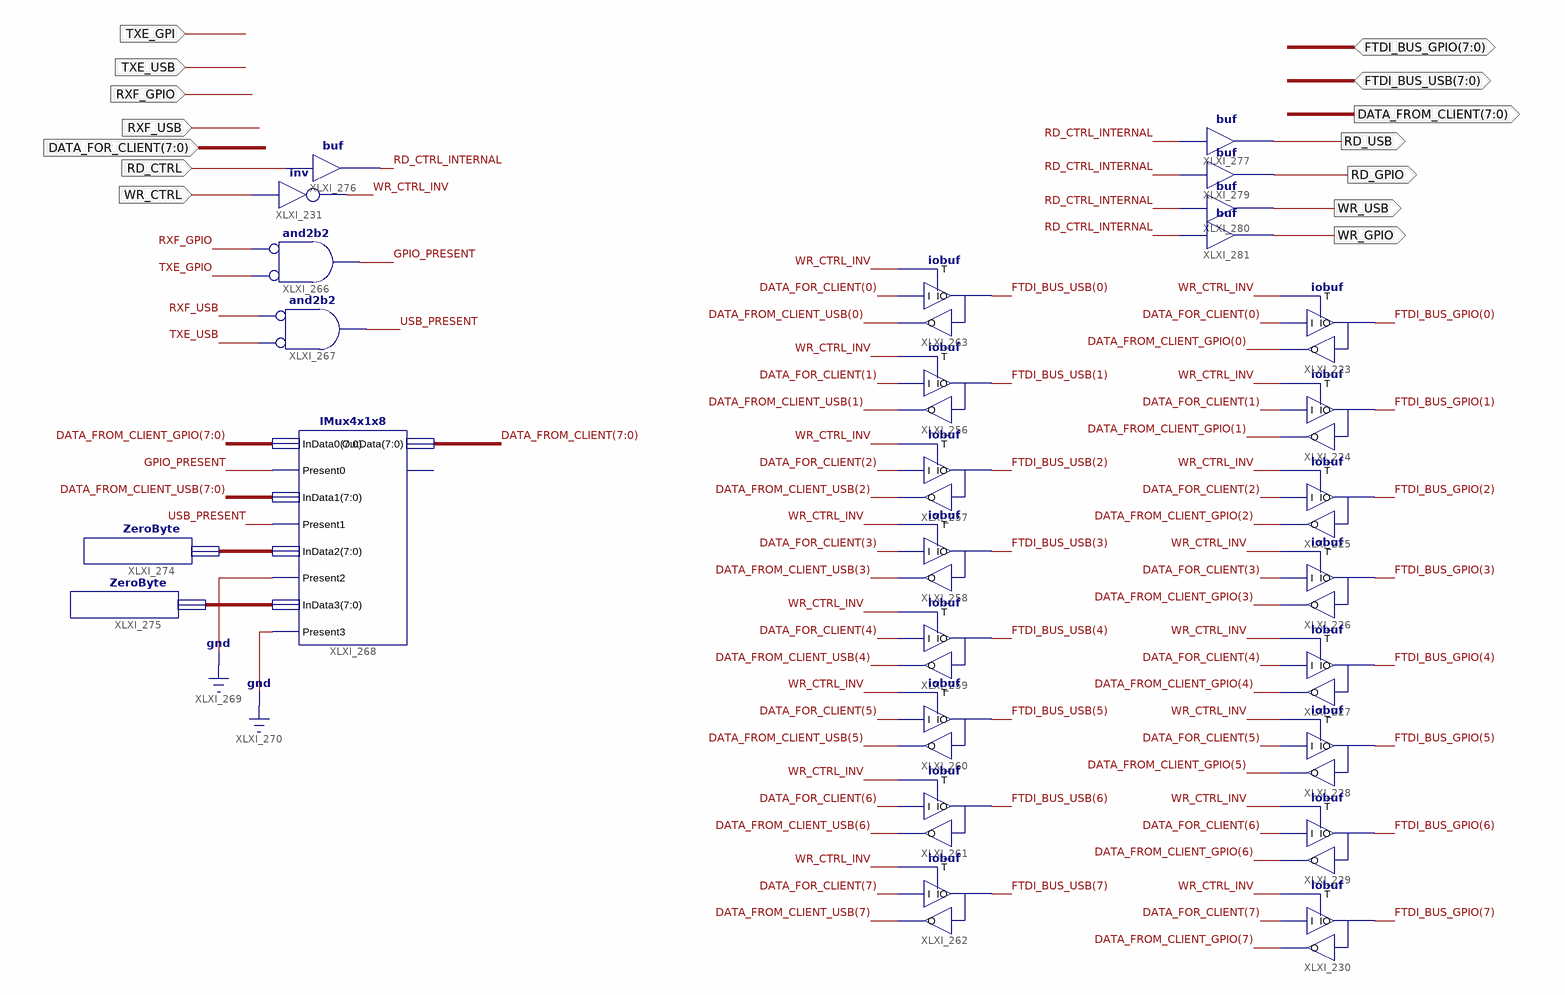
[diagram p0: schematic sheet 1]
// Xilinx ISE schematic SwitchableIoBuffer.sch (spartan6) as structural Verilog: 27 symbols, 15 ports
module SwitchableIoBuffer (
  input  TXE_USB,
  input  TXE_GPI,
  input  RXF_GPIO,
  input  WR_CTRL,
  input  RXF_USB,
  input  [7:0] DATA_FOR_CLIENT,
  input  RD_CTRL,
  inout  [7:0] FTDI_BUS_GPIO,
  inout  [7:0] FTDI_BUS_USB,
  output [7:0] DATA_FROM_CLIENT,
  output RD_GPIO,
  output RD_CTRL_INTERNAL,
  output RD_USB,
  output WR_GPIO,
  output WR_USB
);

  wire GPIO_PRESENT, TXE_GPIO, USB_PRESENT, WR_CTRL_INV;
  wire [7:0] DATA_FROM_CLIENT_GPIO, DATA_FROM_CLIENT_USB, XLXN_205, XLXN_206;

  not XLXI_231 (WR_CTRL_INV, WR_CTRL);
  iobuf XLXI_224 (.I(DATA_FOR_CLIENT[1]), .IO(FTDI_BUS_GPIO[1]), .O(DATA_FROM_CLIENT_GPIO[1]), .T(WR_CTRL_INV));
  iobuf XLXI_225 (.I(DATA_FOR_CLIENT[2]), .IO(FTDI_BUS_GPIO[2]), .O(DATA_FROM_CLIENT_GPIO[2]), .T(WR_CTRL_INV));
  iobuf XLXI_226 (.I(DATA_FOR_CLIENT[3]), .IO(FTDI_BUS_GPIO[3]), .O(DATA_FROM_CLIENT_GPIO[3]), .T(WR_CTRL_INV));
  iobuf XLXI_227 (.I(DATA_FOR_CLIENT[4]), .IO(FTDI_BUS_GPIO[4]), .O(DATA_FROM_CLIENT_GPIO[4]), .T(WR_CTRL_INV));
  iobuf XLXI_228 (.I(DATA_FOR_CLIENT[5]), .IO(FTDI_BUS_GPIO[5]), .O(DATA_FROM_CLIENT_GPIO[5]), .T(WR_CTRL_INV));
  iobuf XLXI_229 (.I(DATA_FOR_CLIENT[6]), .IO(FTDI_BUS_GPIO[6]), .O(DATA_FROM_CLIENT_GPIO[6]), .T(WR_CTRL_INV));
  iobuf XLXI_230 (.I(DATA_FOR_CLIENT[7]), .IO(FTDI_BUS_GPIO[7]), .O(DATA_FROM_CLIENT_GPIO[7]), .T(WR_CTRL_INV));
  iobuf XLXI_223 (.I(DATA_FOR_CLIENT[0]), .IO(FTDI_BUS_GPIO[0]), .O(DATA_FROM_CLIENT_GPIO[0]), .T(WR_CTRL_INV));
  iobuf XLXI_256 (.I(DATA_FOR_CLIENT[1]), .IO(FTDI_BUS_USB[1]), .O(DATA_FROM_CLIENT_USB[1]), .T(WR_CTRL_INV));
  iobuf XLXI_257 (.I(DATA_FOR_CLIENT[2]), .IO(FTDI_BUS_USB[2]), .O(DATA_FROM_CLIENT_USB[2]), .T(WR_CTRL_INV));
  iobuf XLXI_258 (.I(DATA_FOR_CLIENT[3]), .IO(FTDI_BUS_USB[3]), .O(DATA_FROM_CLIENT_USB[3]), .T(WR_CTRL_INV));
  iobuf XLXI_259 (.I(DATA_FOR_CLIENT[4]), .IO(FTDI_BUS_USB[4]), .O(DATA_FROM_CLIENT_USB[4]), .T(WR_CTRL_INV));
  iobuf XLXI_260 (.I(DATA_FOR_CLIENT[5]), .IO(FTDI_BUS_USB[5]), .O(DATA_FROM_CLIENT_USB[5]), .T(WR_CTRL_INV));
  iobuf XLXI_261 (.I(DATA_FOR_CLIENT[6]), .IO(FTDI_BUS_USB[6]), .O(DATA_FROM_CLIENT_USB[6]), .T(WR_CTRL_INV));
  iobuf XLXI_262 (.I(DATA_FOR_CLIENT[7]), .IO(FTDI_BUS_USB[7]), .O(DATA_FROM_CLIENT_USB[7]), .T(WR_CTRL_INV));
  iobuf XLXI_263 (.I(DATA_FOR_CLIENT[0]), .IO(FTDI_BUS_USB[0]), .O(DATA_FROM_CLIENT_USB[0]), .T(WR_CTRL_INV));
  and XLXI_266 (GPIO_PRESENT, ~TXE_GPIO, ~RXF_GPIO);  // and2b2
  and XLXI_267 (USB_PRESENT, ~TXE_USB, ~RXF_USB);  // and2b2
  IMux4x1x8 XLXI_268 (
    .InData0(DATA_FROM_CLIENT_GPIO), .InData1(DATA_FROM_CLIENT_USB), .InData2(XLXN_205), .InData3(XLXN_206),
    .Present3(1'b0), .Present2(1'b0), .Present1(USB_PRESENT), .Present0(GPIO_PRESENT),
    .OutData(DATA_FROM_CLIENT));  // open: Present
  ZeroByte XLXI_274 (.ZeroData(XLXN_205));
  ZeroByte XLXI_275 (.ZeroData(XLXN_206));
  buf XLXI_276 (RD_CTRL_INTERNAL, RD_CTRL);
  buf XLXI_277 (RD_USB, RD_CTRL_INTERNAL);
  buf XLXI_279 (RD_GPIO, RD_CTRL_INTERNAL);
  buf XLXI_280 (WR_USB, RD_CTRL_INTERNAL);
  buf XLXI_281 (WR_GPIO, RD_CTRL_INTERNAL);
endmodule
